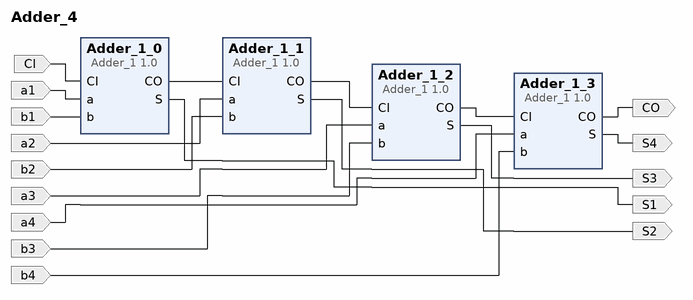
[diagram p0: block diagram of the top level]
# Vivado block design Adder_4, xc7a35tcpg236-1, Vivado 2021.1
create_bd_design Adder_4

create_bd_port -dir I CI
create_bd_port -dir I a1
create_bd_port -dir I a2
create_bd_port -dir I a3
create_bd_port -dir I a4
create_bd_port -dir I b1
create_bd_port -dir I b2
create_bd_port -dir I b3
create_bd_port -dir I b4
create_bd_port -dir O S1
create_bd_port -dir O S2
create_bd_port -dir O S3
create_bd_port -dir O S4
create_bd_port -dir O CO

create_bd_cell -type ip -vlnv xilinx.com:user:Adder_1:1.0 Adder_1_0
create_bd_cell -type ip -vlnv xilinx.com:user:Adder_1:1.0 Adder_1_1
create_bd_cell -type ip -vlnv xilinx.com:user:Adder_1:1.0 Adder_1_2
create_bd_cell -type ip -vlnv xilinx.com:user:Adder_1:1.0 Adder_1_3

# ---- connections ----

connect_bd_net [get_bd_pins Adder_1_0/CO] [get_bd_pins Adder_1_1/CI]
connect_bd_net [get_bd_pins Adder_1_0/S] [get_bd_ports S1]
connect_bd_net [get_bd_pins Adder_1_1/CO] [get_bd_pins Adder_1_2/CI]
connect_bd_net [get_bd_pins Adder_1_1/S] [get_bd_ports S2]
connect_bd_net [get_bd_pins Adder_1_2/CO] [get_bd_pins Adder_1_3/CI]
connect_bd_net [get_bd_pins Adder_1_2/S] [get_bd_ports S3]
connect_bd_net [get_bd_pins Adder_1_3/CO] [get_bd_ports CO]
connect_bd_net [get_bd_pins Adder_1_3/S] [get_bd_ports S4]
connect_bd_net [get_bd_ports CI] [get_bd_pins Adder_1_0/CI]
connect_bd_net -net a1_1 [get_bd_ports a1] [get_bd_pins Adder_1_0/a]
connect_bd_net -net a2_1 [get_bd_ports a2] [get_bd_pins Adder_1_1/a]
connect_bd_net -net a3_1 [get_bd_ports a3] [get_bd_pins Adder_1_2/a]
connect_bd_net -net a4_1 [get_bd_ports a4] [get_bd_pins Adder_1_3/a]
connect_bd_net -net b1_1 [get_bd_ports b1] [get_bd_pins Adder_1_0/b]
connect_bd_net -net b2_1 [get_bd_ports b2] [get_bd_pins Adder_1_1/b]
connect_bd_net -net b3_1 [get_bd_ports b3] [get_bd_pins Adder_1_2/b]
connect_bd_net -net b4_1 [get_bd_ports b4] [get_bd_pins Adder_1_3/b]

validate_bd_design
save_bd_design
